# Altium schematic sheet DemDis.SchDoc
size A4
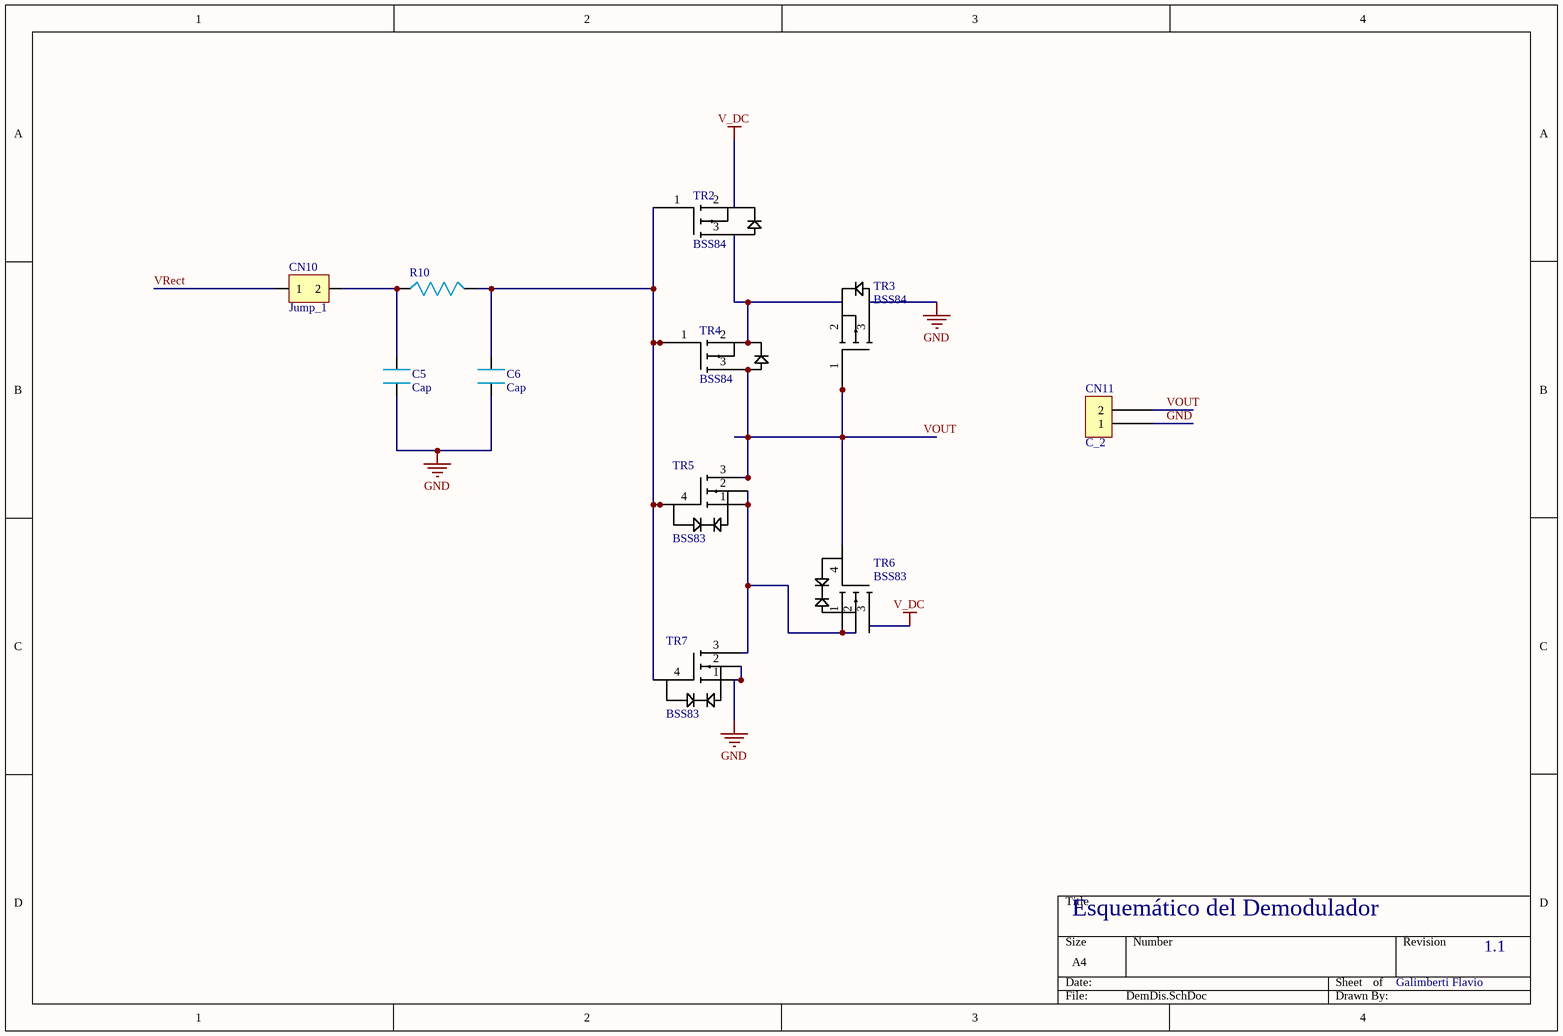
[diagram p0: DemDis.SchDoc]

## Parts
C5  Cap  [C_1210]
C6  Cap  [C_1210]
CN10  Jump_1  [2x1 Pin Array]
CN11  C_2  [2x1 Pin Array]
R10  R_1/4  [R_1210]  (value not drawn)
TR2  BSS84  [SOT_23]
TR3  BSS84  [SOT_23]
TR4  BSS84  [SOT_23]
TR5  BSS83  [BSS83]
TR6  BSS83  [BSS83]
TR7  BSS83  [BSS83]

## Nets
GND: C5.2 C6.2 CN11.1 TR3.3(d) TR7.1(s) TR7.2(b)
V_DC: TR2.2(s) TR6.3(d)
VOUT: CN11.2 TR3.1(g) TR4.3(d) TR5.3(d) TR6.4(g)
VRect: CN10.1
NetC5_1: C5.1 CN10.2 R10.1
NetC6_1: C6.1 R10.2 TR2.1(g) TR4.1(g) TR5.4(g) TR7.4(g)
NetTR2_3: TR2.3(d) TR3.2(s) TR4.2(s)
NetTR5_1: TR5.1(s) TR5.2(b) TR6.1(s) TR6.2(b) TR7.3(d)

## Notes on the sheet
- Esquemático del Demodulador
- Galimberti Flavio
- 1.1

## Library data of the parts
C5 C6 = Cap: Ceramic Capacitor
CN10 = Jump_1: Conector 2 pines
CN11 = C_2: Conector 2 pines
R10 = R_1/4: Chip Resistor